# Altium schematic sheet LevelShift.SchDoc
size A4; Author: T. Kreppel; CompanyName: Technische Universität München; Organization: TUM EAL; Address1: Arcisstraße 21; Address2: 80333 München; Address3: GERMANY; SheetNumber: 3; SheetTotal: 6; CompanyName2: Lehrstuhl für Elektrische Antriebsrechnik u. Leistungselektronik
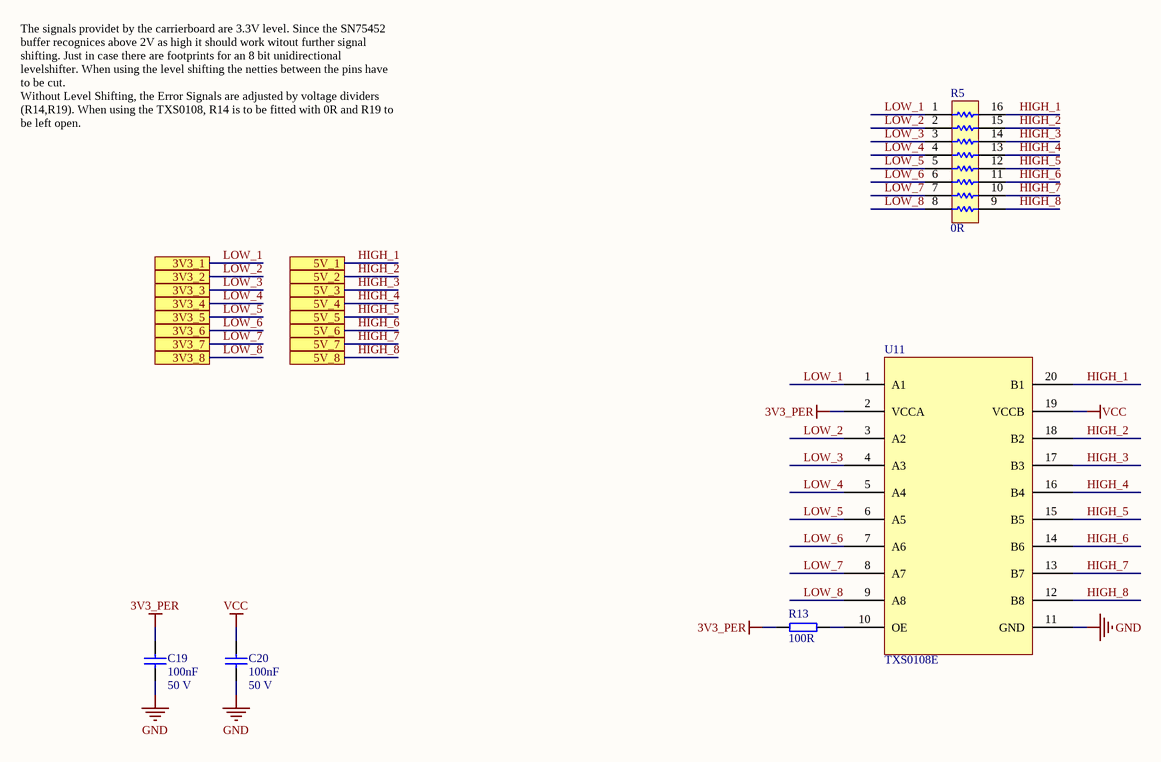
[diagram p0: LevelShift.SchDoc]

## Parts
C19  Rated Voltage: 50 V  [C_0603(1608)100_L]  (hidden comment: 100nF)
C20  Rated Voltage: 50 V  [C_0603(1608)100_L]  (hidden comment: 100nF)
R5  0R  [CAF-50P380X160-16N]
R13  100R  [R_0603_N]
U11  TXS0108E  [TXS0108E]  (net tie)

## Ports
3V3_1, 3V3_2, 3V3_3, 3V3_4, 3V3_5, 3V3_6, 3V3_7, 3V3_8, 5V_1, 5V_2, 5V_3, 5V_4, 5V_5, 5V_6, 5V_7, 5V_8

## Nets
3V3_PER: C19.1 R13.1 U11.2(VCCA)
GND: C19.2 C20.2 U11.11(GND)
VCC: C20.1 U11.19(VCCB)
HIGH_1: R5.16 U11.20(B1) ; port 5V_1
HIGH_2: R5.15 U11.18(B2) ; port 5V_2
HIGH_3: R5.14 U11.17(B3) ; port 5V_3
HIGH_4: R5.13 U11.16(B4) ; port 5V_4
HIGH_5: R5.12 U11.15(B5) ; port 5V_5
HIGH_6: R5.11 U11.14(B6) ; port 5V_6
HIGH_7: R5.10 U11.13(B7) ; port 5V_7
HIGH_8: R5.9 U11.12(B8) ; port 5V_8
LOW_1: R5.1 U11.1(A1) ; port 3V3_1
LOW_2: R5.2 U11.3(A2) ; port 3V3_2
LOW_3: R5.3 U11.4(A3) ; port 3V3_3
LOW_4: R5.4 U11.5(A4) ; port 3V3_4
LOW_5: R5.5 U11.6(A5) ; port 3V3_5
LOW_6: R5.6 U11.7(A6) ; port 3V3_6
LOW_7: R5.7 U11.8(A7) ; port 3V3_7
LOW_8: R5.8 U11.9(A8) ; port 3V3_8
NetR13_2: R13.2 U11.10(OE)

## Notes on the sheet
- The signals providet by the carrierboard are 3.3V level. Since the SN75452 buffer recognices above 2V as high it should work witout further signal shifting. Just in case there are footprints for an 8 bit unidirectional levelshifter. When using the level shifting the netties between the pins have to be cut.
  Without Level Shifting, the Error Signals are adjusted by voltage dividers (R14,R19). When using the TXS0108, R14 is to be fitted with 0R and R19 to be left open.
- Title
- Size:
- Date:
- A4
- Revision:
- Time:
- Sheet
- of
- Author:
- Project:

## Library data of the parts
C19 C20 = C_0603: CAP 0603 (1608 Metric) SMD; MPN: CC0603MRY5V9BB104; Tolerance: ±20%; Case-Metric: 1608; Dielectric: X5V; MF: Yageo; Case-EIA: 0603; Max Thickness: 1 mm; Technology: SMT; Created: 2018_09_06_AGeiger; Supplier 1: Mouser; Supplier Part Number 1: 603-C0603MRY5V9BB104; Value: 100nF; Package: 0603
R5 = R_0402_Array_8R: Chip Resistor Array; MPN: CAY16-000J8LF; MF: Bourns; Package: 0402; Created: 2018_10_30_AGeiger; Value: 0R; Supplier Part Number 1: 652-CAY16-000J8LF; Supplier 1: Mouser; ComponentLink1Description: Datasheet; ComponentLink1URL: https://www.mouser.de/datasheet/2/315/AOC0000C14-1108062.pdf
R13 = R_0603: SMD Resistor 0603; MPN: CRCW0603100RFKEAC; Tolerance: 1%; Voltage: 75V; Power: 100 mW; MF: Vishay; Package: 0603; Value: 100R; Created: 2018_09_06_AGeiger; Supplier 1: Mouser; Supplier Part Number 1: 71-CRCW0603100RFKEAC
U11 = TXS0108E: 8 Ch. Bidirectional Voltage-Level translator